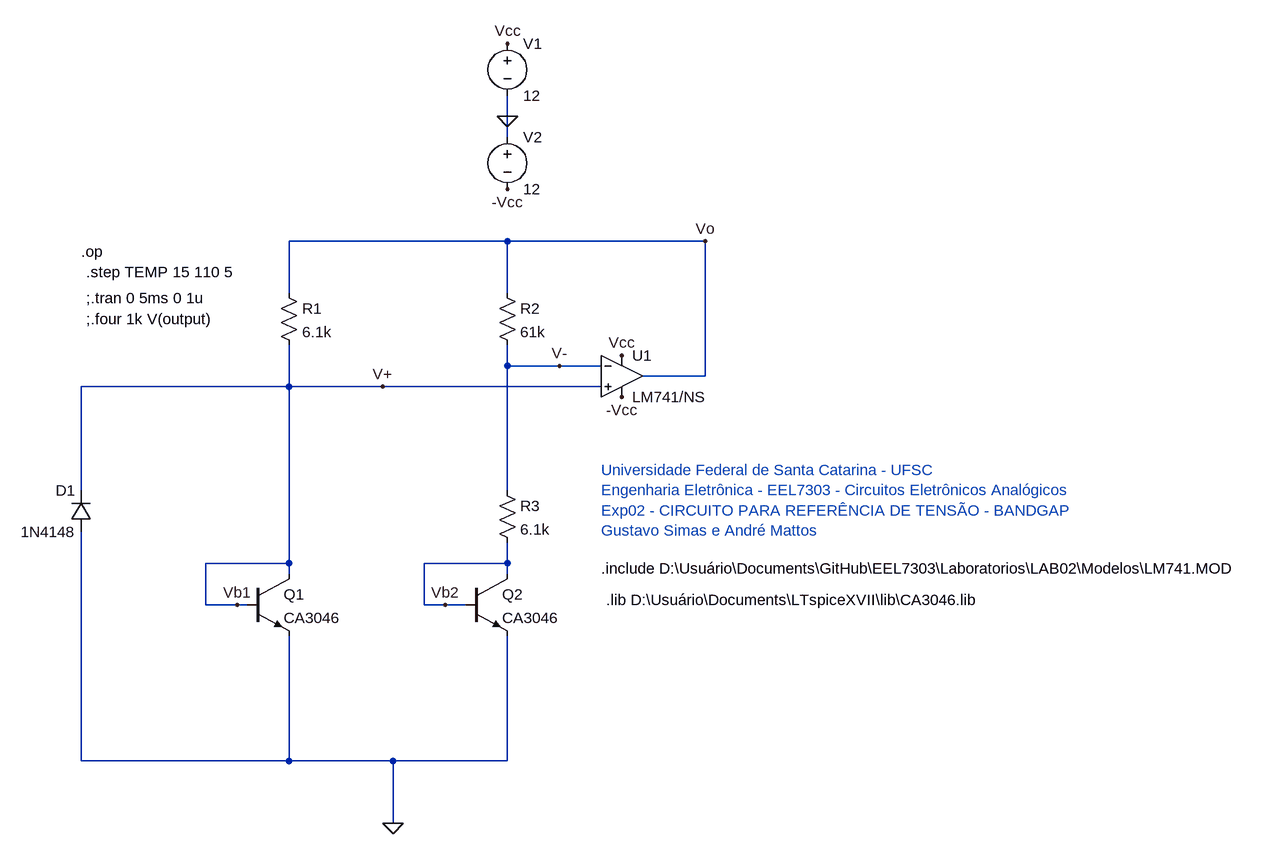
[diagram p0: schematic Lab02.asc]
Lab02.asc, the LTspice schematic file:
Version 4
SHEET 1 2024 680
WIRE 544 -464 544 -496
WIRE 544 -432 544 -464
WIRE 544 -272 208 -272
WIRE 848 -272 544 -272
WIRE 208 -192 208 -272
WIRE 544 -192 544 -272
WIRE 544 -80 544 -112
WIRE 624 -80 544 -80
WIRE 688 -80 624 -80
WIRE 848 -64 848 -272
WIRE 848 -64 752 -64
WIRE 208 -48 208 -112
WIRE 208 -48 -112 -48
WIRE 352 -48 208 -48
WIRE 688 -48 352 -48
WIRE -112 112 -112 -48
WIRE 544 112 544 -80
WIRE 208 224 208 -48
WIRE 208 224 80 224
WIRE 544 224 544 192
WIRE 544 224 416 224
WIRE 208 240 208 224
WIRE 544 240 544 224
WIRE 80 288 80 224
WIRE 128 288 80 288
WIRE 144 288 128 288
WIRE 416 288 416 224
WIRE 448 288 416 288
WIRE 480 288 448 288
WIRE -112 528 -112 176
WIRE 208 528 208 336
WIRE 208 528 -112 528
WIRE 368 528 208 528
WIRE 544 528 544 336
WIRE 544 528 368 528
WIRE 368 624 368 528
FLAG 368 624 0
FLAG 544 -464 0
FLAG 544 -352 -Vcc
FLAG 544 -576 Vcc
FLAG 720 -96 Vcc
FLAG 720 -32 -Vcc
FLAG 848 -272 Vo
FLAG 352 -48 V+
FLAG 624 -80 V-
FLAG 448 288 Vb2
FLAG 128 288 Vb1
SYMBOL npn 144 240 R0
SYMATTR InstName Q1
SYMATTR Value CA3046
SYMBOL res 192 -208 R0
SYMATTR InstName R1
SYMATTR Value 6.1k
SYMBOL res 528 -208 R0
SYMATTR InstName R2
SYMATTR Value 61k
SYMBOL res 528 96 R0
SYMATTR InstName R3
SYMATTR Value 6.1k
SYMBOL diode -96 176 R180
WINDOW 0 24 64 Left 2
WINDOW 3 24 0 Left 2
SYMATTR InstName D1
SYMATTR Value 1N4148
SYMBOL npn 480 240 R0
SYMATTR InstName Q2
SYMATTR Value CA3046
SYMBOL Opamps\\opamp2 720 -128 R0
SYMATTR InstName U1
SYMATTR Value LM741/NS
SYMBOL voltage 544 -592 R0
WINDOW 123 0 0 Left 0
WINDOW 39 0 0 Left 0
SYMATTR InstName V1
SYMATTR Value 12
SYMBOL voltage 544 -448 R0
WINDOW 123 0 0 Left 0
WINDOW 39 0 0 Left 0
SYMATTR InstName V2
SYMATTR Value 12
TEXT 688 232 Left 2 !.include D:\\Usuário\\Documents\\GitHub\\EEL7303\\Laboratorios\\LAB02\\Modelos\\LM741.MOD
TEXT -112 -256 Left 2 !.op
TEXT -104 -224 Left 2 !.step TEMP 15 110 5
TEXT -104 -184 Left 2 !;.tran 0 5ms 0 1u
TEXT -104 -152 Left 2 !;.four 1k V(output)
TEXT 688 80 Left 2 ;Universidade Federal de Santa Catarina - UFSC\nEngenharia Eletrônica - EEL7303 - Circuitos Eletrônicos Analógicos\nExp02 - CIRCUITO PARA REFERÊNCIA DE TENSÃO - BANDGAP\nGustavo Simas e André Mattos
TEXT 696 280 Left 2 !.lib D:\\Usuário\\Documents\\LTspiceXVII\\lib\\CA3046.lib

The netlist it stands for:
* Lab02.asc
Q1 Vb1 Vb1 0 0 CA3046
R1 Vo Vb1 6.1k
R2 Vo V- 61k
R3 V- Vb2 6.1k
D1 0 Vb1 1N4148
Q2 Vb2 Vb2 0 0 CA3046
XU1 Vb1 V- Vcc -Vcc Vo LM741/NS  ; pins In+ In- V+ V- OUT
V1 Vcc 0 12
V2 0 -Vcc 12
.model D D
.lib standard.dio
.model NPN NPN
.model PNP PNP
.lib standard.bjt
.include D:\Usuário\Documents\GitHub\EEL7303\Laboratorios\LAB02\Modelos\LM741.MOD
.op
.step TEMP 15 110 5
;.tran 0 5ms 0 1u
;.four 1k V(output)
* Universidade Federal de Santa Catarina - UFSC
* Engenharia Eletrônica - EEL7303 - Circuitos Eletrônicos Analógicos
* Exp02 - CIRCUITO PARA REFERÊNCIA DE TENSÃO - BANDGAP
* Gustavo Simas e André Mattos
.lib D:\Usuário\Documents\LTspiceXVII\lib\CA3046.lib
.backanno
.end